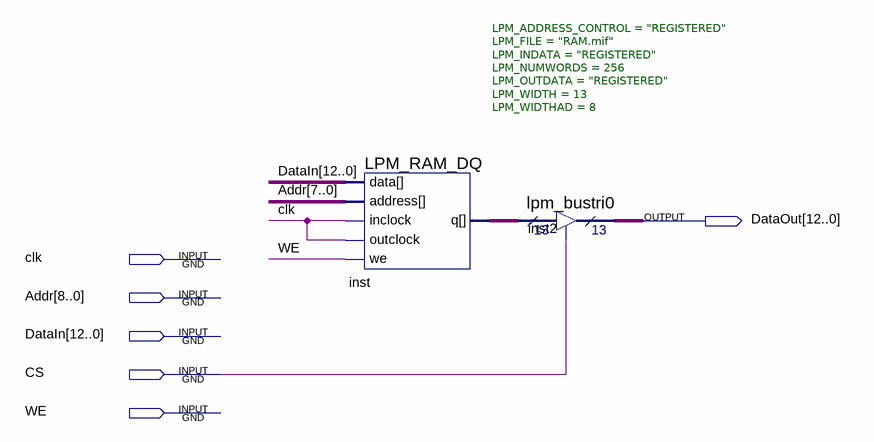
[diagram p0: schematic sheet]
// Quartus schematic RAM.bdf as structural Verilog: 2 symbols, 6 pins
module RAM (
  input  clk,
  input  [8:0] Addr,
  input  [12:0] DataIn,
  input  CS,
  input  WE,
  output [12:0] DataOut
);

  wire [12:0] inst_q;

  LPM_RAM_DQ #(.LPM_ADDRESS_CONTROL("REGISTERED"), .LPM_FILE("RAM.mif"), .LPM_INDATA("REGISTERED"), .LPM_NUMWORDS(256), .LPM_OUTDATA("REGISTERED"), .LPM_WIDTH(13), .LPM_WIDTHAD(8)) inst (
    .inclock(clk), .data(DataIn), .address(Addr[7:0]), .we(WE), .outclock(clk), .q(inst_q));
  lpm_bustri0 inst2 (.enabledt(CS), .data(inst_q), .tridata(DataOut));
endmodule
